# EAGLE design SiNEDevBoard (EAGLE 6.2)
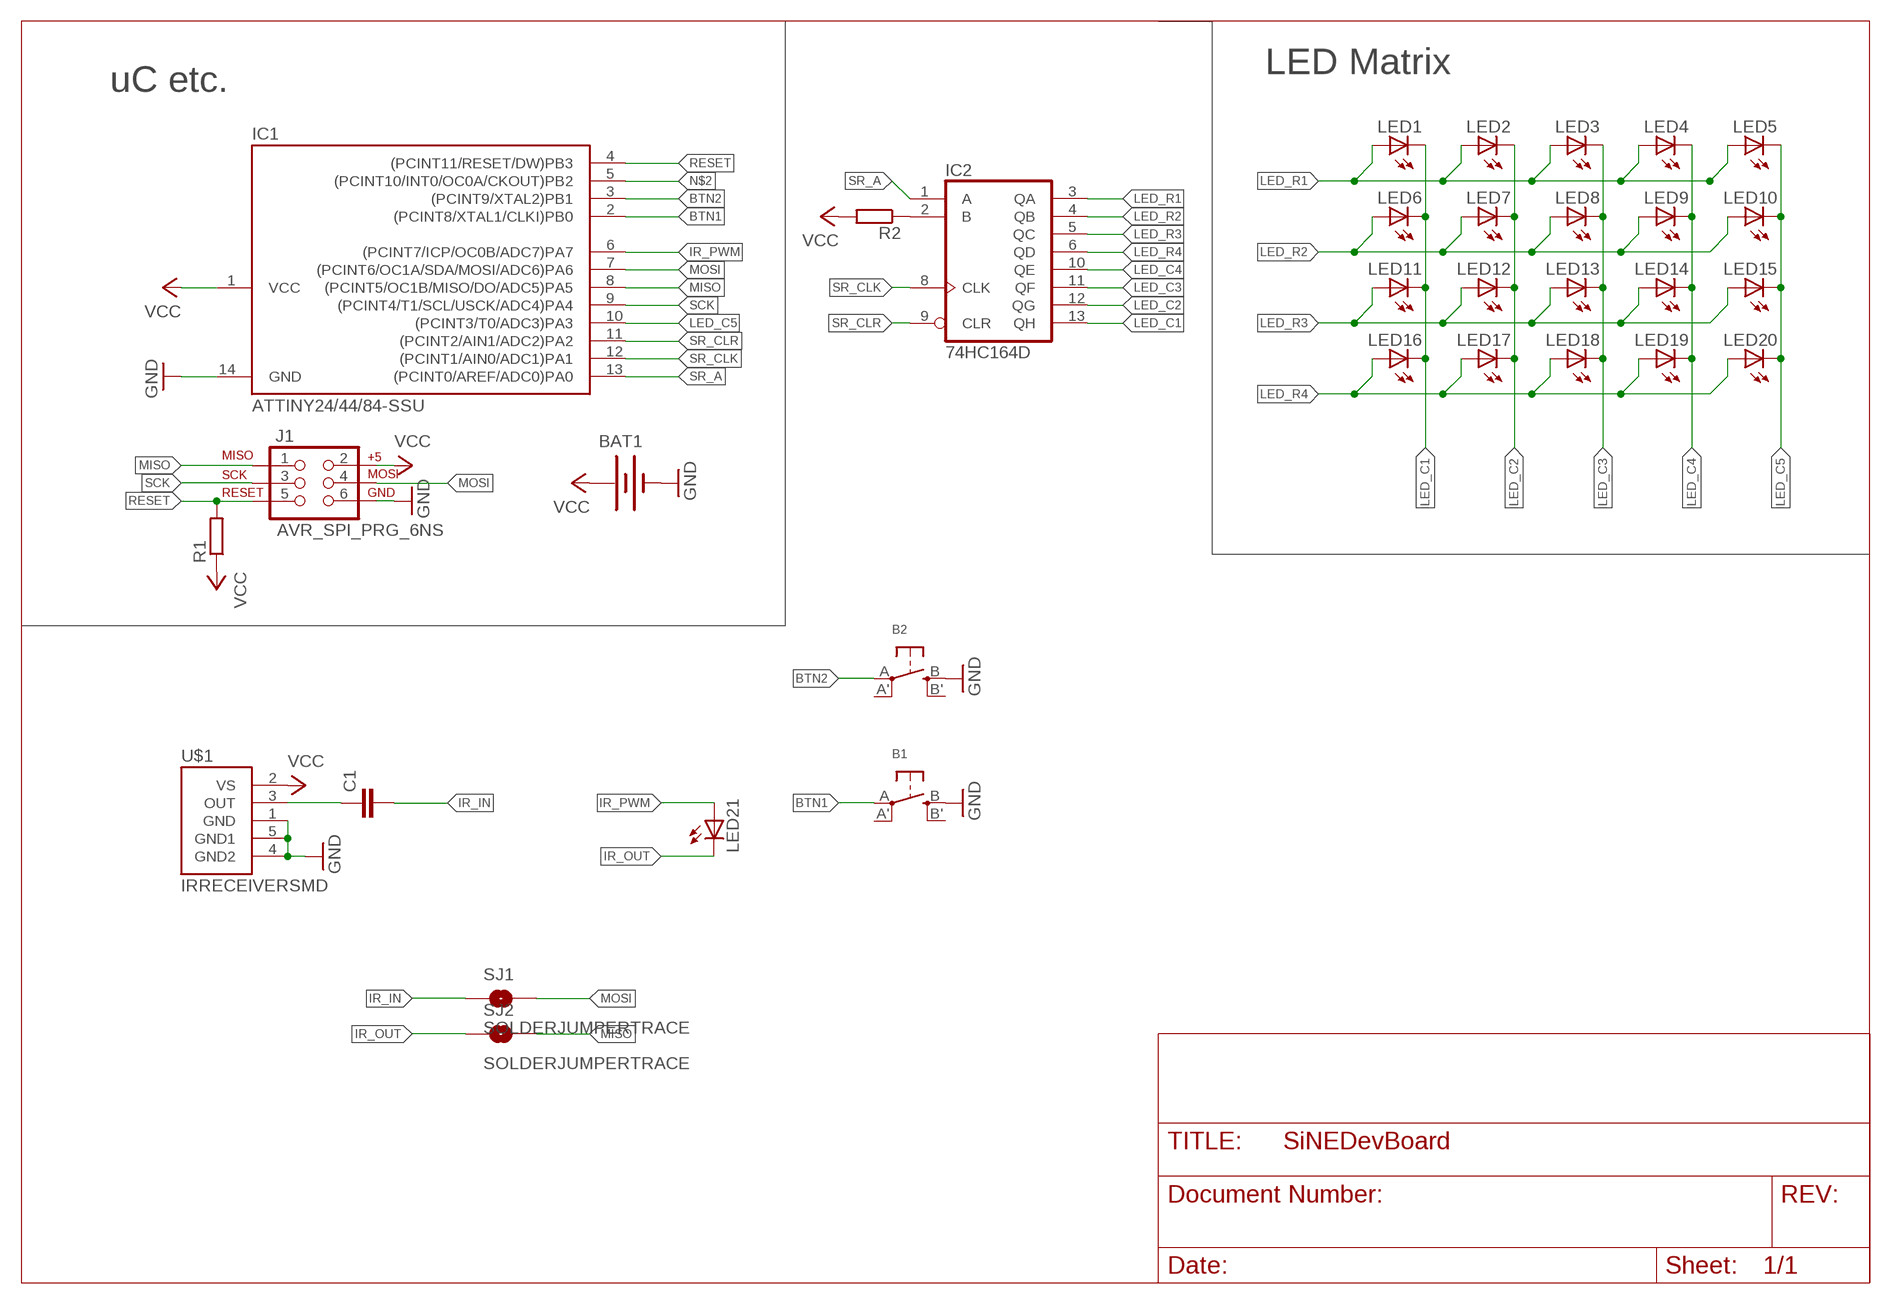
[diagram p0: schematic, sheet 1]

## Parts
B1  SWITCH_TACT_SMT  [EVQ-Q2]
B2  SWITCH_TACT_SMT  [EVQ-Q2]
BAT1  BATTERY20SMD  [BATTCON_20MM]
C1  C-EUC0805  [C0805]
IC1  ATTINY24/44/84-SSU  [SOIC14]
IC2  74HC164D  [SO14]
J1  AVR_SPI_PRG_6NS  [2X3-NS]
LED1  LEDCHIPLED_0805  [CHIPLED_0805]
LED2  LEDCHIPLED_0805  [CHIPLED_0805]
LED3  LEDCHIPLED_0805  [CHIPLED_0805]
LED4  LEDCHIPLED_0805  [CHIPLED_0805]
LED5  LEDCHIPLED_0805  [CHIPLED_0805]
LED6  LEDCHIPLED_0805  [CHIPLED_0805]
LED7  LEDCHIPLED_0805  [CHIPLED_0805]
LED8  LEDCHIPLED_0805  [CHIPLED_0805]
LED9  LEDCHIPLED_0805  [CHIPLED_0805]
LED10  LEDCHIPLED_0805  [CHIPLED_0805]
LED11  LEDCHIPLED_0805  [CHIPLED_0805]
LED12  LEDCHIPLED_0805  [CHIPLED_0805]
LED13  LEDCHIPLED_0805  [CHIPLED_0805]
LED14  LEDCHIPLED_0805  [CHIPLED_0805]
LED15  LEDCHIPLED_0805  [CHIPLED_0805]
LED16  LEDCHIPLED_0805  [CHIPLED_0805]
LED17  LEDCHIPLED_0805  [CHIPLED_0805]
LED18  LEDCHIPLED_0805  [CHIPLED_0805]
LED19  LEDCHIPLED_0805  [CHIPLED_0805]
LED20  LEDCHIPLED_0805  [CHIPLED_0805]
LED21  LEDCHIPLED_1206  [CHIPLED_1206]
R1  R-EU_R0805  [R0805]
R2  R-EU_R0805  [R0805]
SJ1  SOLDERJUMPERTRACE  [SJ_2S-TRACE]
SJ2  SOLDERJUMPERTRACE  [SJ_2S-TRACE]
U$1  IRRECEIVERSMD  [TSOP8523]

## Nets
BTN1: B1.A(P) IC1.2((PCINT8/XTAL1/CLKI)PB0)
BTN2: B2.A(P) IC1.3((PCINT9/XTAL2)PB1)
GND: B1.B(S) B2.B(S) BAT1.2(-) IC1.14(GND) J1.6 U$1.1(GND) U$1.4(GND2) U$1.5(GND1)
IR_IN: C1.2 SJ1.1
IR_OUT: LED21.C SJ2.1
IR_PWM: IC1.6((PCINT7/ICP/OC0B/ADC7)PA7) LED21.A
LED_C1: IC2.13(QH) LED1.C LED6.C LED11.C LED16.C
LED_C2: IC2.12(QG) LED2.C LED7.C LED12.C LED17.C
LED_C3: IC2.11(QF) LED3.C LED8.C LED13.C LED18.C
LED_C4: IC2.10(QE) LED4.C LED9.C LED14.C LED19.C
LED_C5: IC1.10((PCINT3/T0/ADC3)PA3) LED5.C LED10.C LED15.C LED20.C
LED_R1: IC2.3(QA) LED1.A LED2.A LED3.A LED4.A LED5.A
LED_R2: IC2.4(QB) LED6.A LED7.A LED8.A LED9.A LED10.A
LED_R3: IC2.5(QC) LED11.A LED12.A LED13.A LED14.A LED15.A
LED_R4: IC2.6(QD) LED16.A LED17.A LED18.A LED19.A LED20.A
MISO: IC1.8((PCINT5/OC1B/MISO/DO/ADC5)PA5) J1.1 SJ2.2
MOSI: IC1.7((PCINT6/OC1A/SDA/MOSI/ADC6)PA6) J1.4 SJ1.2
N$1: IC2.2(B) R2.1
N$2: IC1.5((PCINT10/INT0/OC0A/CKOUT)PB2)
N$6: C1.1 U$1.3(OUT)
RESET: IC1.4((PCINT11/RESET/DW)PB3) J1.5 R1.2
SCK: IC1.9((PCINT4/T1/SCL/USCK/ADC4)PA4) J1.3
SR_A: IC1.13((PCINT0/AREF/ADC0)PA0) IC2.1(A)
SR_CLK: IC1.12((PCINT1/AIN0/ADC1)PA1) IC2.8(CLK)
SR_CLR: IC1.11((PCINT2/AIN1/ADC2)PA2) IC2.9(CLR)
VCC: BAT1.1(+) IC1.1(VCC) J1.2 R1.1 R2.2 U$1.2(VS)
Unconnected: B1.A'(P1) B1.B'(S1) B2.A'(P1) B2.B'(S1)

## Notes on the sheet
- LED Matrix
- uC etc.

## Power pins joined to a net without a drawn wire
GND: IC2.7(GND)
VCC: IC2.14(VCC)

## Library data of the parts
B1 B2 = microbuilder:SWITCH_TACT_SMT: SMT Tact Switches 6x6mm - Digikey: P12940SCT-ND KMR2 (4.6x2.8mm) - Digikey: 401-1426-1-ND EVQ-PQHB55 - Light Touch, 160GF (4.5x4.5mm) - Digikey: P8090SCT-ND
BAT1 = SparkFun:BATTERY: Battery Holders Various common sizes : AA, AAA, 20mm coin cell and 12mm coin cell.
C1 = rcl:C-EU: CAPACITOR, European symbol
IC1 = attiny24_44_84:ATTINY24/44/84
IC2 = 74xx-eu:74*164: 8-bit parallel out SHIFT REGISTER
J1 = AVR Header:AVR_SPI_PRG_6: AVR ISP 6 Pin This is the reduced ISP connector for AVR programming. Common on Arduino. This footprint will take up less PCB space and can be used with a 10-pin to 6-pin adapter such as SKU: BOB-08508
LED1-LED20 = adafruit:LED: LED
LED21 = led:LED: LED
R1 R2 = rcl:R-EU_: RESISTOR, European symbol
SJ1 SJ2 = SparkFun:SOLDERJUMPER: Solder Jumper Standard SMD solder jumper. Used to automate production. Two varients : Normally Open and Normally Closed are the same, but have different paste layers. NC will have a large amount of paste and should jumper during reflow.
U$1 = SparkFun:IRRECEIVER: Description: IR receiver with built in demodulation and filtering. SparkFun SKU: SEN-08545

## Board
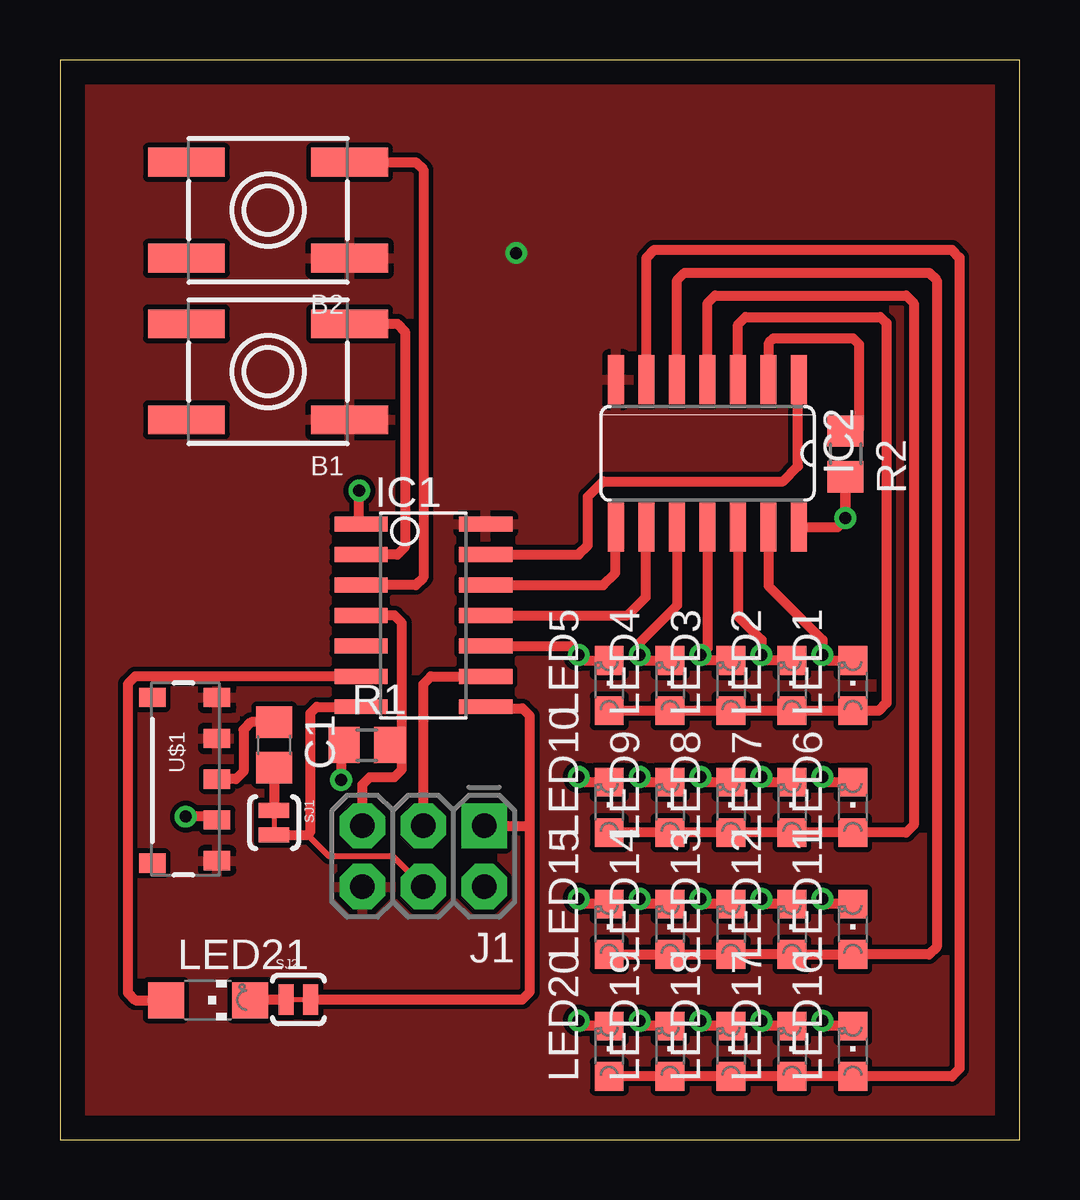
[diagram p1: board, top side]
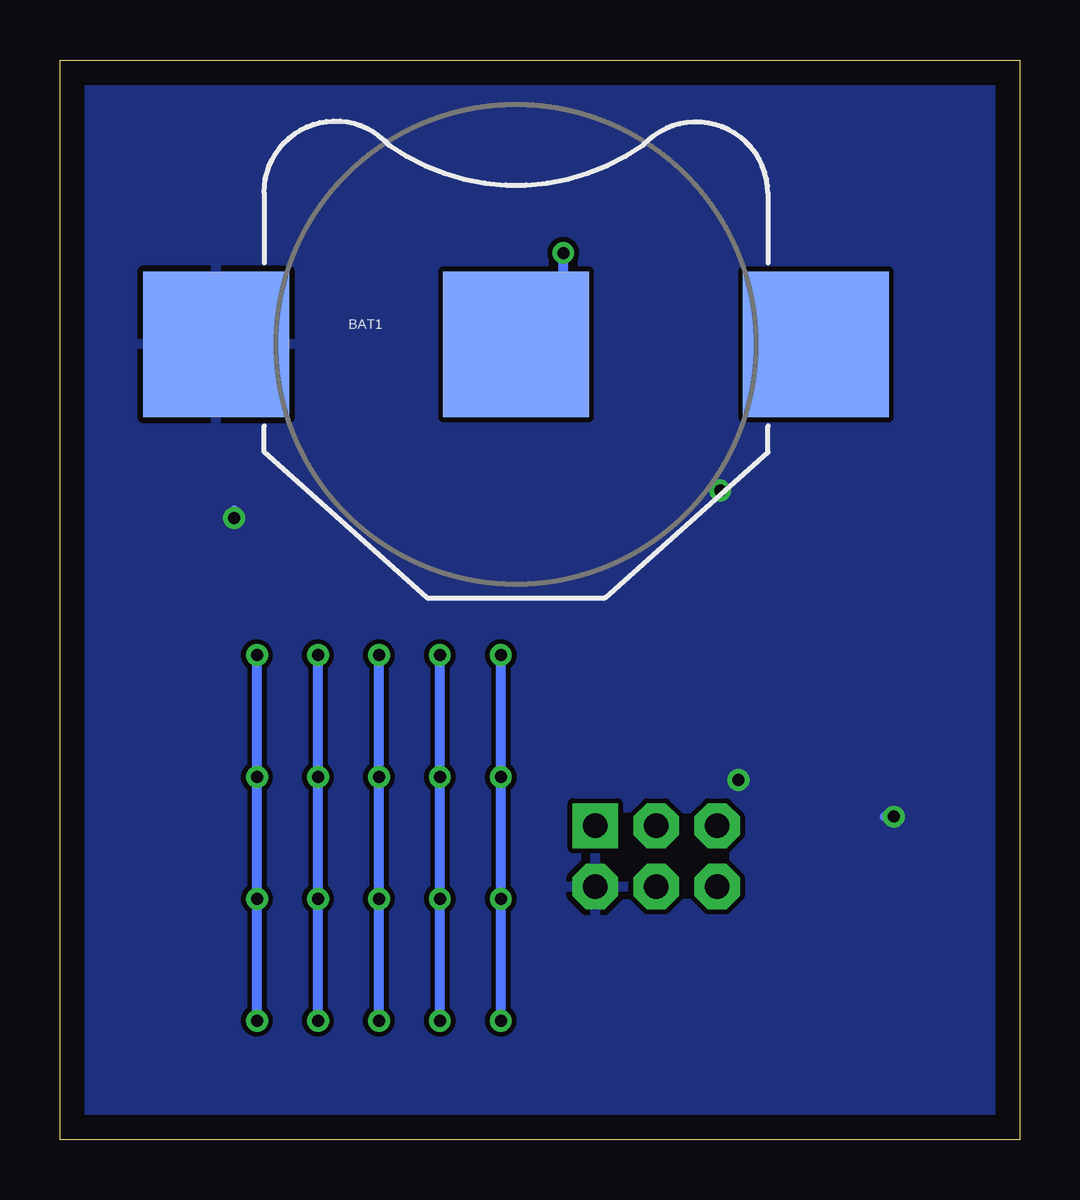
[diagram p2: board, bottom side, seen from below]

Size 40 x 45 mm. Coordinates in mm from the lower left corner, seen from the top.
Outline: 0,0 40,0 40,45 0,45 0,0
Copper layers (1*16): Top 0.035mm / dielectric 1.5mm / Bottom 0.035mm
Design rules: minimum track width 10mil, minimum drill 0.6mm, track to track 8mil, track to pad 8mil, pad to pad 8mil, via to via 8mil, smd to smd 8mil, copper to edge 40mil, drill to drill 8mil, minimum pad ring 10mil, minimum via ring 8mil, stop-mask expansion 4mil, vias tented up to drill 0mil, thermal gap 10mil

### Footprints (pad centres in the part's own frame; a part is rotated, then mirrored left to right if it is on the bottom)
EVQ-Q2 = smd 3.2 x 1.2: A -3.4,-2; A' 3.4,-2; B -3.4,2; B' 3.4,2
BATTCON_20MM = smd 6.07 x 6.07: 1 -12.5,0; 2 0,0; 3 12.5,0
C0805 = smd 1.3 x 1.5: 1 -0.95,0; 2 0.95,0
SOIC14 = smd 0.61 x 2.21: 1 -3.81,-2.603; 2 -2.54,-2.603; 3 -1.27,-2.603; 4 0,-2.603; 5 1.27,-2.603; 6 2.54,-2.603; 7 3.81,-2.603; 8 3.81,2.603; 9 2.54,2.603; 10 1.27,2.603; 11 0,2.603; 12 -1.27,2.603; 13 -2.54,2.603; 14 -3.81,2.603
SO14 = smd 0.66 x 2.032: 1 -3.81,-3.073; 2 -2.54,-3.073; 3 -1.27,-3.073; 4 0,-3.073; 5 1.27,-3.073; 6 2.54,-3.073; 7 3.81,-3.073; 8 3.81,3.073; 9 2.54,3.073; 10 1.27,3.073; 11 0,3.073; 12 -1.27,3.073; 13 -2.54,3.073; 14 -3.81,3.073
2X3-NS = drill 1.016 pad 1.88 square: 1 -2.54,-1.27 | drill 1.016 pad 1.88 octagon: 2 -2.54,1.27; 3 0,-1.27; 4 0,1.27; 5 2.54,-1.27; 6 2.54,1.27
CHIPLED_0805 = smd 1.2 x 1.2: A 0,-1.05; C 0,1.05
CHIPLED_1206 = smd 1.5 x 1.5: A 0,-1.75; C 0,1.75
R0805 = smd 1.3 x 1.5: 1 -0.95,0; 2 0.95,0
SJ_2S-TRACE = smd 0.635 x 1.27: 1 -0.508,0; 2 0.508,0
TSOP8523 = smd 0.8 x 1.1: 1 3.4,0; 2 1.7,0; 3 0,0; 4 -1.7,0; 5 -3.4,0; P$1 -3.4,-2.7; P$2 3.5,-2.7

### Placement (x,y rotation side)
B1  8.67,32 180 top
B2  8.67,38.73 180 top
BAT1  20.99,33.15 0 bottom
C1  8.93,16.45 270 top
IC1  15.15,21.84 270 top
IC2  26.99,28.6 180 top
J1  15.15,11.81 180 top
LED1  33.05,18.92 0 top
LED2  30.51,18.92 0 top
LED3  27.97,18.92 0 top
LED4  25.43,18.92 0 top
LED5  22.89,18.92 0 top
LED6  33.05,13.84 0 top
LED7  30.51,13.84 0 top
LED8  27.97,13.84 0 top
LED9  25.43,13.84 0 top
LED10  22.89,13.84 0 top
LED11  33.05,8.76 0 top
LED12  30.51,8.76 0 top
LED13  27.97,8.76 0 top
LED14  25.43,8.76 0 top
LED15  22.89,8.76 0 top
LED16  33.05,3.68 0 top
LED17  30.51,3.68 0 top
LED18  27.97,3.68 0 top
LED19  25.43,3.68 0 top
LED20  22.89,3.68 0 top
LED21  6.17,5.81 270 top
R1  12.8,16.45 0 top
R2  32.74,28.58 270 top
SJ1  8.92,13.21 270 top
SJ2  9.94,5.84 0 top
U$1  6.55,15.02 270 top

### Tracks (layer width: path | path; a pad name or v marks a point on that pad's centre or on a via)
BTN1
  Top 0.406: B1.A 14.07,34 14.38,33.69 14.38,24.7 14.07,24.38 IC1.2
BTN2
  Top 0.406: B2.A 14.83,40.73 15.15,40.42 15.15,23.43 14.83,23.11 IC1.3
GND  (via drill 0.5)
  Bottom 0.406: 19.08,37.02 v19.02,36.96 19.02,35.12 arc90 BAT1.2
  pour Top: -11.59,52.39 41.44,52.39 41.75,52.07 41.75,-2.54 -11.27,-2.54 -11.59,-2.22
IR_IN
  Top 0.406: C1.2 SJ1.1
IR_OUT
  Top 0.406: LED21.C 7.95,5.84 SJ2.1
IR_PWM
  Top 0.406: IC1.6 3.14,19.3 2.83,18.99 2.83,6.13 3.14,5.81 LED21.A
LED_C1  (via drill 0.5)
  Top 0.406: LED16.C 32,4.73 v31.78,4.95 | LED1.C 32,19.97 v31.78,20.19 31.78,20.83 29.53,23.08 IC2.13 | LED11.C 32,9.81 v31.78,10.03 | LED6.C 32,14.89 v31.78,15.11
  Bottom 0.406: v31.78,4.95 v31.78,10.03 v31.78,15.11 v31.78,20.19
LED_C2  (via drill 0.5)
  Top 0.406: LED17.C 29.46,4.73 v29.24,4.95 | LED12.C 29.46,9.81 v29.24,10.03 | LED7.C 29.46,14.89 v29.24,15.11 | LED2.C 29.46,19.97 v29.24,20.19 29.24,20.83 28.26,21.81 IC2.12
  Bottom 0.406: v29.24,4.95 v29.24,10.03 v29.24,15.11 v29.24,20.19
LED_C3  (via drill 0.5)
  Top 0.406: LED18.C 26.92,4.73 v26.7,4.95 | LED13.C 26.92,9.81 v26.7,10.03 | LED8.C 26.92,14.89 v26.7,15.11 | LED3.C 26.92,19.97 v26.7,20.19 26.99,20.48 IC2.11
  Bottom 0.406: v26.7,4.95 v26.7,10.03 v26.7,15.11 v26.7,20.19
LED_C4  (via drill 0.5)
  Top 0.406: LED19.C 24.38,4.73 v24.16,4.95 | LED4.C 24.38,19.97 v24.16,20.19 24.16,20.7 25.72,22.26 IC2.10 | LED14.C 24.38,9.81 v24.16,10.03 | LED9.C 24.38,14.89 v24.16,15.11
  Bottom 0.406: v24.16,4.95 v24.16,10.03 v24.16,15.11 v24.16,20.19
LED_C5  (via drill 0.5)
  Top 0.406: LED20.C 21.84,4.73 v21.62,4.95 | LED5.C 21.84,19.97 v21.62,20.19 21.62,20.26 21.3,20.57 IC1.10 | LED15.C 21.84,9.81 v21.62,10.03 | LED10.C 21.84,14.89 v21.62,15.11
  Bottom 0.406: v21.62,4.95 v21.62,10.03 v21.62,15.11 v21.62,20.19
LED_R1
  Top 0.406: LED5.A LED4.A LED3.A LED2.A LED1.A 34.13,17.87 34.45,18.19 34.45,34.04 34.2,34.29 28.58,34.29 28.26,33.97 IC2.3
LED_R2
  Top 0.406: LED10.A LED9.A LED8.A LED7.A LED6.A 35.28,12.79 35.59,13.11 35.59,34.86 35.28,35.18 27.31,35.18 26.99,34.86 IC2.4
LED_R3
  Top 0.406: LED15.A LED14.A LED13.A LED12.A LED11.A 36.23,7.71 36.55,8.03 36.55,35.81 36.23,36.13 26.04,36.13 25.72,35.81 IC2.5
LED_R4
  Top 0.406: LED20.A LED19.A LED18.A LED17.A LED16.A 37.18,2.63 37.5,2.95 37.5,36.77 37.18,37.08 24.77,37.08 24.45,36.77 IC2.6
MISO
  Top 0.406: IC1.8 17.69,17.97 19.27,17.97 19.59,17.65 19.59,13.08 | SJ2.2 19.27,5.84 19.59,6.16 19.59,13.08 | J1.1 19.59,13.08
MOSI
  Top 0.254: J1.4 13.88,11.81 11.21,11.81 10.45,12.57 10.45,12.83
  Top 0.406: IC1.7 10.7,18.03 10.45,17.78 10.45,12.83 10.32,12.7 SJ1.2
N$1
  Top 0.406: IC2.2 29.56,31.65 29.56,33.21 29.75,33.4 33.05,33.4 33.31,33.15 33.31,29.6 R2.1
N$6
  Top 0.406: C1.1 7.97,17.4 7.65,17.08 7.65,15.34 7.33,15.02 U$1.3
RESET
  Top 0.406: J1.5 12.61,14.8 12.92,15.11 13.94,15.11 14.26,15.43 14.26,16.51 | 14.26,16.51 14.26,21.53 13.94,21.84 IC1.4 | R1.2 14.19,16.45 14.26,16.51
SCK
  Top 0.406: J1.3 15.15,18.99 15.46,19.3 IC1.9
SR_A
  Top 0.406: IC1.13 21.62,24.38 22,24.77 22,26.8 22.64,27.43 30.13,27.43 30.77,28.07 30.77,31.64 IC2.1
SR_CLK
  Top 0.406: IC1.12 22.64,23.11 23.15,23.62 23.15,25.49 IC2.8
SR_CLR
  Top 0.406: IC1.11 23.66,21.84 24.42,22.61 24.42,25.49 IC2.9
VCC  (via drill 0.5)
  Top 0.406: IC2.14 32.42,25.53 32.74,25.85 R2.2 v32.74,25.91 | R1.1 11.72,16.32 v11.72,14.99 | IC1.1 12.48,25.72 v12.48,27.05 | U$1.2 6.41,13.46 v5.24,13.46
  Bottom 0.406: v32.74,25.91 32.74,26.23 | v11.72,14.99 11.72,15.24 | v12.48,27.05 12.48,26.92 | v5.24,13.46 5.62,13.46
  pour Bottom: -11.9,54.93 43.98,54.61 44.29,54.29 44.29,-2.86 -11.9,-2.86 -12.22,-2.54 -12.22,54.61